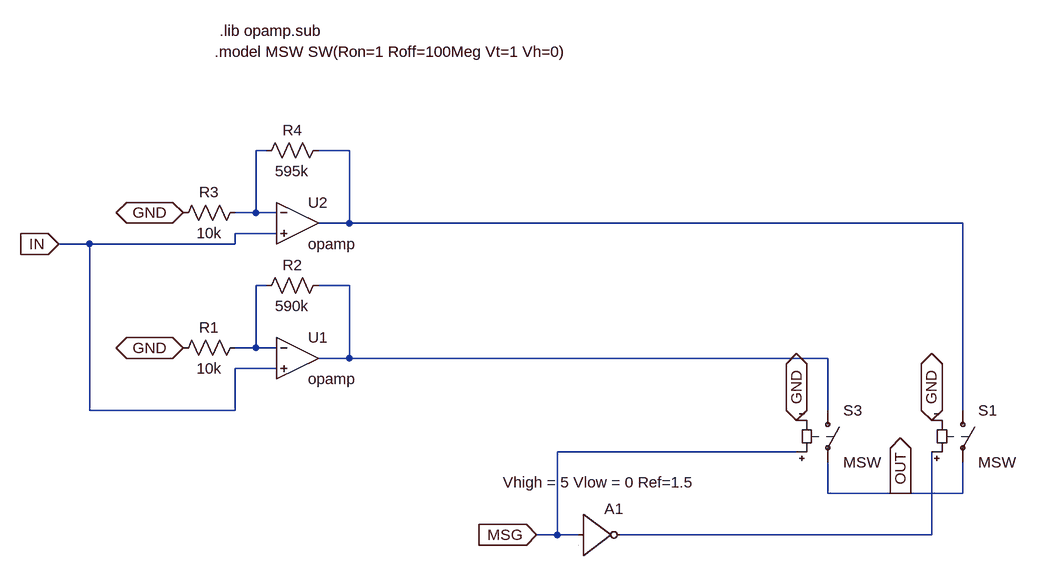
[diagram p0: schematic BetaSwitch.asc]
BetaSwitch.asc, the LTspice schematic file:
Version 4
SHEET 1 1068 712
WIRE -96 48 -112 48
WIRE 32 48 -16 48
WIRE -112 144 -112 48
WIRE -112 144 -144 144
WIRE -80 144 -112 144
WIRE 32 160 32 48
WIRE 32 160 -16 160
WIRE 976 160 32 160
WIRE -80 176 -144 176
WIRE -368 192 -416 192
WIRE -144 192 -144 176
WIRE -144 192 -368 192
WIRE -96 256 -112 256
WIRE 32 256 -16 256
WIRE -112 352 -112 256
WIRE -112 352 -144 352
WIRE -80 352 -112 352
WIRE 32 368 32 256
WIRE 32 368 -16 368
WIRE 768 368 32 368
WIRE -80 384 -144 384
WIRE -368 448 -368 192
WIRE -144 448 -144 384
WIRE -144 448 -368 448
WIRE 768 448 768 368
WIRE 976 448 976 160
WIRE 720 512 352 512
WIRE 768 576 768 528
WIRE 880 576 768 576
WIRE 976 576 976 528
WIRE 976 576 880 576
WIRE 352 640 352 512
WIRE 352 640 320 640
WIRE 384 640 352 640
WIRE 928 640 928 512
WIRE 928 640 448 640
FLAG -224 144 GND
IOPIN -224 144 BiDir
FLAG -416 192 IN
IOPIN -416 192 In
FLAG 880 576 OUT
IOPIN 880 576 Out
FLAG 320 640 MSG
IOPIN 320 640 In
FLAG 720 464 GND
IOPIN 720 464 BiDir
FLAG 928 464 GND
IOPIN 928 464 BiDir
FLAG -224 352 GND
IOPIN -224 352 BiDir
SYMBOL Opamps\\opamp -48 96 R0
SYMATTR InstName U2
SYMBOL res -128 128 R90
WINDOW 0 0 56 VBottom 2
WINDOW 3 32 56 VTop 2
SYMATTR InstName R3
SYMATTR Value 10k
SYMBOL res 0 32 R90
WINDOW 0 0 56 VBottom 2
WINDOW 3 32 56 VTop 2
SYMATTR InstName R4
SYMATTR Value 595k
SYMBOL Digital\\inv 384 576 R0
WINDOW 3 -116 -17 Left 2
SYMATTR Value Vhigh = 5 Vlow = 0 Ref=1.5
SYMATTR InstName A1
SYMATTR Value2 Trise = 1n Tfall = 1n Td =1n
SYMBOL Opamps\\opamp -48 304 R0
SYMATTR InstName U1
SYMBOL res -128 336 R90
WINDOW 0 0 56 VBottom 2
WINDOW 3 32 56 VTop 2
SYMATTR InstName R1
SYMATTR Value 10k
SYMBOL res 0 240 R90
WINDOW 0 0 56 VBottom 2
WINDOW 3 32 56 VTop 2
SYMATTR InstName R2
SYMATTR Value 590k
SYMBOL sw 768 432 R0
SYMATTR InstName S3
SYMATTR Value MSW
SYMBOL sw 976 432 R0
SYMATTR InstName S1
SYMATTR Value MSW
TEXT -168 -136 Left 2 !.lib opamp.sub
TEXT -176 -104 Left 2 !.model MSW SW(Ron=1 Roff=100Meg Vt=1 Vh=0)

The netlist it stands for:
* BetaSwitch.asc
XU2 N001 IN N002 opamp Aol=100K GBW=10Meg  ; pins invin noninvin out
R3 N001 GND 10k
R4 N002 N001 595k
A1 MSG 0 0 0 0 N005 0 0 BUF Vhigh = 5 Vlow = 0 Ref=1.5 Trise = 1n Tfall = 1n Td =1n
XU1 N003 IN N004 opamp Aol=100K GBW=10Meg  ; pins invin noninvin out
R1 N003 GND 10k
R2 N004 N003 590k
S3 N004 OUT MSG GND MSW
S1 N002 OUT N005 GND MSW
.lib opamp.sub
.model MSW SW(Ron=1 Roff=100Meg Vt=1 Vh=0)
.backanno
.end